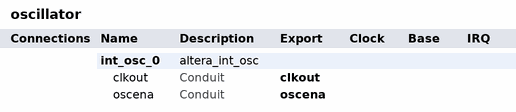
[diagram p0: system contents]
# Platform Designer (Qsys) system oscillator, Cyclone IV E EP4CE115F29C7
# Parameters at their usual value, and those the tool derives, are not listed.
package require -exact qsys 14.0
create_system oscillator
set_project_property DEVICE_FAMILY {Cyclone IV E}
set_project_property DEVICE EP4CE115F29C7

add_instance int_osc_0 altera_int_osc 14.0
set_instance_property int_osc_0 AUTO_EXPORT true
set_instance_parameter_value int_osc_0 CBX_AUTO_BLACKBOX ALL

# exported interfaces
add_interface oscena conduit end
set_interface_property oscena EXPORT_OF int_osc_0.oscena
add_interface clkout conduit end
set_interface_property clkout EXPORT_OF int_osc_0.clkout

set_interconnect_requirement {$system} qsys_mm.clockCrossingAdapter HANDSHAKE
set_interconnect_requirement {$system} qsys_mm.maxAdditionalLatency 1
set_interconnect_requirement {$system} qsys_mm.insertDefaultSlave FALSE

save_system oscillator.qsys
